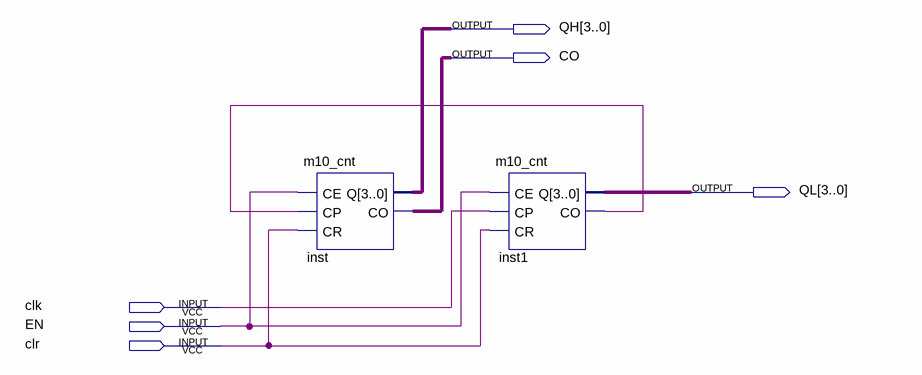
[diagram p0: schematic sheet]
// Quartus schematic m100_cnt.bdf as structural Verilog: 2 symbols, 6 pins
module m100_cnt (
  input  clk,
  input  EN,
  input  clr,
  output [3:0] QH,
  output CO,
  output [3:0] QL
);

  wire inst1_co;

  m10_cnt inst (.CE(EN), .CP(inst1_co), .CR(clr), .Q(QH), .CO(CO));
  m10_cnt inst1 (.CE(EN), .CP(clk), .CR(clr), .Q(QL), .CO(inst1_co));
endmodule
